# Altium project Module Hub.PrjPcb
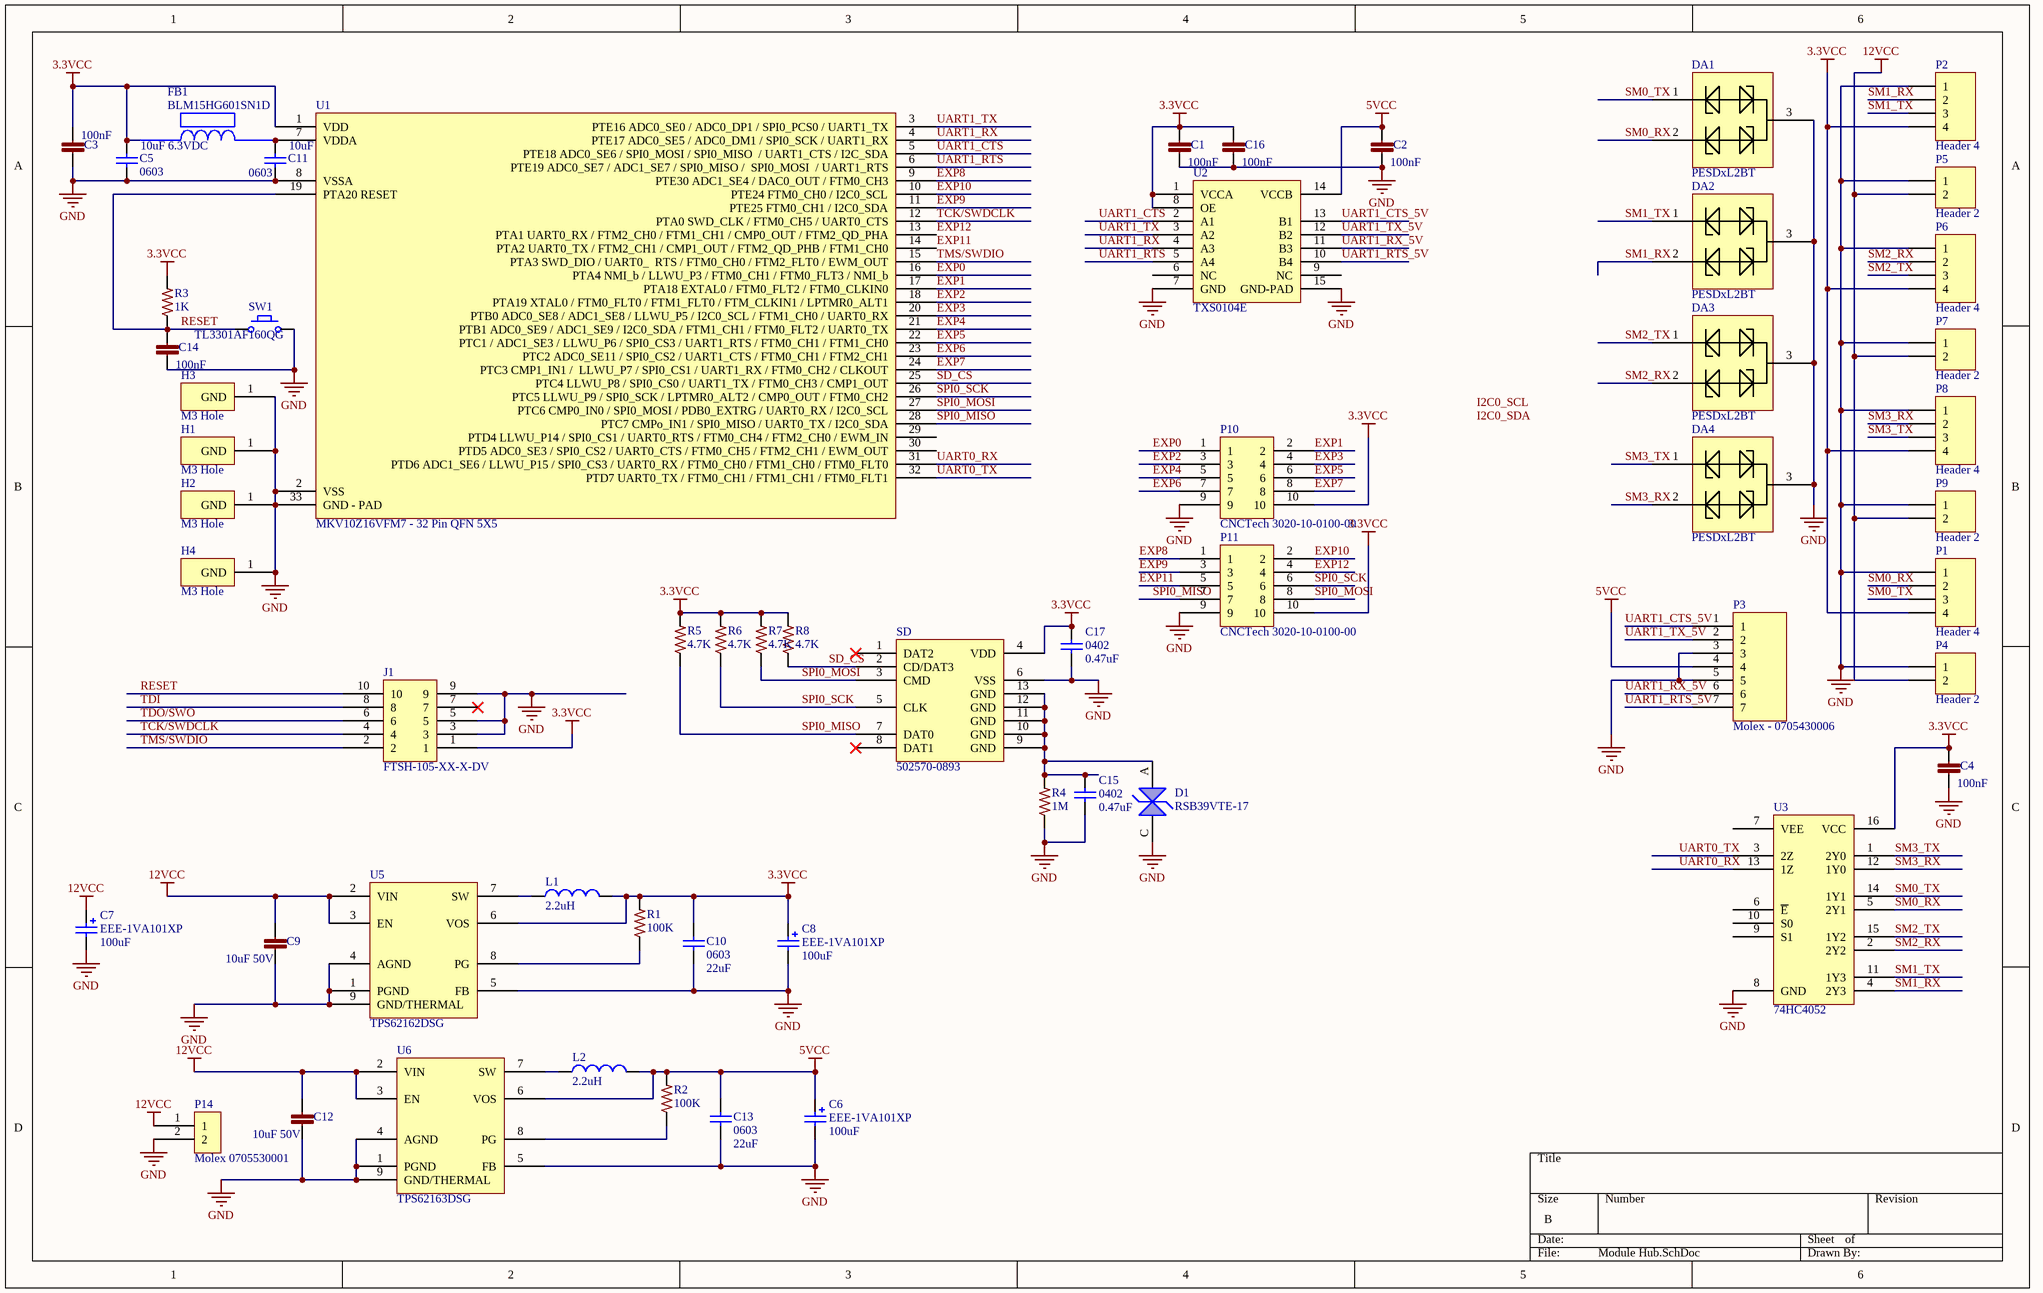
[diagram p0: Module Hub.SchDoc]
1 sheet, 57 parts. Net scope: global (net labels, ports and power ports of the same name join across sheets).
Board file: Module Hub.PcbDoc

## Sheet Module Hub.SchDoc
size B

### Parts
C1  100nF  [C0603]
C2  100nF  [C0603]
C3  100nF  [C0603]
C4  100nF  [C0603]
C5  0603  value 10uF 6.3VDC  [C0603]
C6  EEE-1VA101XP  value 100uF  [EEE-1VA101XP]
C7  EEE-1VA101XP  value 100uF  [EEE-1VA101XP]
C8  EEE-1VA101XP  value 100uF  [EEE-1VA101XP]
C9  10uF 50V  [C1206]
C10  0603  value 22uF  [C0805]
C11  0603  value 10uF  [C0603]
C12  10uF 50V  [C1206]
C13  0603  value 22uF  [C0805]
C14  100nF  [C0402]
C15  value 0.47uF  [C0402]  (hidden comment: 0402)
C16  100nF  [C0603]
C17  value 0.47uF  [C0402]  (hidden comment: 0402)
D1  RSB39VTE-17  [SOD323-R]
DA1  PESDxL2BT  [SOT95P230X110-3N]
DA2  PESDxL2BT  [SOT95P230X110-3N]
DA3  PESDxL2BT  [SOT95P230X110-3N]
DA4  PESDxL2BT  [SOT95P230X110-3N]
FB1  BLM15HG601SN1D  [BLM18PG121SN1D]
H1  M3 Hole  [Hole-3mm]
H2  M3 Hole  [Hole-3mm]
H3  M3 Hole  [Hole-3mm]
H4  M3 Hole  [Hole-3mm]
J1  FTSH-105-XX-X-DV  [FTSH-105-XX-X-DV]
L1  value 2.2uH  [VLS252012T-2R2M1R3]  (hidden comment: VLS252012T-2R2M1R3)
L2  value 2.2uH  [VLS252012T-2R2M1R3]  (hidden comment: VLS252012T-2R2M1R3)
P1  Header 4  [HDR1X4]
P2  Header 4  [HDR1X4]
P3  Molex - 0705430006  [0705530041]
P4  Header 2  [HDR1X2]
P5  Header 2  [HDR1X2]
P6  Header 4  [HDR1X4]
P7  Header 2  [HDR1X2]
P8  Header 4  [HDR1X4]
P9  Header 2  [HDR1X2]
P10  CNCTech 3020-10-0100-00  [3020-10-0100-00]
P11  CNCTech 3020-10-0100-00  [3020-10-0100-00]
P14  Molex 0705530001  [0705530001]
R1  100K  [R0603]
R2  100K  [R0603]
R3  1K  [R0603]
R4  1M  [R0402]
R5  4.7K  [R0603]
R6  4.7K  [R0603]
R7  4.7K  [R0603]
R8  4.7K  [R0603]
SD  502570-0893  [502570-0893 - Molex SD]
SW1  TL3301AF160QG  [TL3301AF160QG]
U1  MKV10Z16VFM7 - 32 Pin QFN 5X5  [MKV10Z16VFM7]
U2  TXS0104E  [RGY  (S-PVQFN-N14)]
U3  74HC4052  [74HC4052]
U5  TPS62162DSG  [DSG8-1600X900TP]
U6  TPS62163DSG  [DSG8-1600X900TP]

### Nets
3.3VCC: C1.1 C3.1 C4.1 C5.2 C8.1 C10.2 C16.1 C17.2 FB1.1 J1.1 L1.2 P1.4 P2.4 P6.4 P8.4 P10.10 P11.10 R1.2 R3.2 R5.2 R6.2 R7.2 R8.2 SD.4(VDD) U1.1(VDD) U2.1(VCCA) U2.8(OE) U3.16(VCC) U5.6(VOS)
5VCC: C2.1 C6.1 C13.2 L2.2 P3.4 R2.2 U2.14(VCCB) U6.6(VOS)
12VCC: C7.1 C9.1 C12.1 P4.2 P5.2 P7.2 P9.2 P14.1 U5.2(VIN) U5.3(EN) U6.2(VIN) U6.3(EN)
GND: C1.2 C2.2 C3.2 C4.2 C5.1 C6.2 C7.2 C8.2 C9.2 C10.1 C11.1 C12.2 C13.1 C14.2 C15.1 C16.2 C17.1 D1.C DA1.3 DA2.3 DA3.3 DA4.3 H1.1(GND) H2.1(GND) H3.1(GND) H4.1(GND) J1.3 J1.5 J1.9 P1.1 P2.1 P3.3 P3.5 P4.1 P5.1 P6.1 P7.1 P8.1 P9.1 P10.9 P11.9 P14.2 R4.1 SD.6(VSS) SW1.2 U1.2(VSS) U1.8(VSSA) U1.33(GND_-_PAD) U2.7(GND) U2.15(GND-PAD) U3.8(GND) U5.1(PGND) U5.4(AGND) U5.5(FB) U5.9(GND/THERMAL) U6.1(PGND) U6.4(AGND) U6.5(FB) U6.9(GND/THERMAL)
EXP0: P10.1 U1.16(PTA4_NMI_b_/_LLWU_P3_/_FTM0_CH1_/_FTM0_FLT3_/_NMI_b)
EXP1: P10.2 U1.17(PTA18_EXTAL0_/_FTM0_FLT2_/_FTM0_CLKIN0)
EXP2: P10.3 U1.18(PTA19_XTAL0_/_FTM0_FLT0_/_FTM1_FLT0_/_FTM_CLKIN1_/_LPTMR0_ALT1)
EXP3: P10.4 U1.20(PTB0_ADC0_SE8_/_ADC1_SE8_/_LLWU_P5_/_I2C0_SCL_/_FTM1_CH0_/_UART0_RX)
EXP4: P10.5 U1.21(PTB1_ADC0_SE9_/_ADC1_SE9_/_I2C0_SDA_/_FTM1_CH1_/_FTM0_FLT2_/_UART0_TX)
EXP5: P10.6 U1.22(PTC1_/_ADC1_SE3_/_LLWU_P6_/_SPI0_CS3_/_UART1_RTS_/_FTM0_CH1_/_FTM1_CH0)
EXP6: P10.7 U1.23(PTC2_ADC0_SE11_/_SPI0_CS2_/_UART1_CTS_/_FTM0_CH1_/_FTM2_CH1)
EXP7: P10.8 U1.24(PTC3_CMP1_IN1_/__LLWU_P7_/_SPI0_CS1_/_UART1_RX_/_FTM0_CH2_/_CLKOUT)
EXP8: P11.1 U1.9(PTE30_ADC1_SE4_/_DAC0_OUT_/_FTM0_CH3)
EXP9: P11.3 U1.11(PTE25_FTM0_CH1_/_I2C0_SDA)
EXP10: P11.2 U1.10(PTE24_FTM0_CH0_/_I2C0_SCL)
EXP11: P11.5 U1.14(PTA2_UART0_TX_/_FTM2_CH1_/_CMP1_OUT_/_FTM2_QD_PHB_/_FTM1_CH0)
EXP12: P11.4 U1.13(PTA1_UART0_RX_/_FTM2_CH0_/_FTM1_CH1_/_CMP0_OUT_/_FTM2_QD_PHA)
RESET: C14.1 J1.10 R3.1 SW1.1 U1.19(PTA20_RESET)
SD_CS: R8.1 SD.2(CD/DAT3) U1.25(PTC4_LLWU_P8_/_SPI0_CS0_/_UART1_TX_/_FTM0_CH3_/_CMP1_OUT)
SM0_RX: DA1.2 P1.2 U3.5(2Y1)
SM0_TX: DA1.1 P1.3 U3.14(1Y1)
SM1_RX: DA2.2 P2.2 U3.4(2Y3)
SM1_TX: DA2.1 P2.3 U3.11(1Y3)
SM2_RX: DA3.2 P6.2 U3.2(2Y2)
SM2_TX: DA3.1 P6.3 U3.15(1Y2)
SM3_RX: DA4.2 P8.2 U3.12(1Y0)
SM3_TX: DA4.1 P8.3 U3.1(2Y0)
SPI0_MISO: P11.7 R5.1 SD.7(DAT0) U1.28(PTC7_CMPo_IN1_/_SPI0_MISO_/_UART0_TX_/_I2C0_SDA)
SPI0_MOSI: P11.8 R7.1 SD.3(CMD) U1.27(PTC6_CMP0_IN0_/_SPI0_MOSI_/_PDB0_EXTRG_/_UART0_RX_/_I2C0_SCL)
SPI0_SCK: P11.6 R6.1 SD.5(CLK) U1.26(PTC5_LLWU_P9_/_SPI0_SCK_/_LPTMR0_ALT2_/_CMP0_OUT_/_FTM0_CH2)
TCK/SWDCLK: J1.4 U1.12(PTA0_SWD_CLK_/_FTM0_CH5_/_UART0_CTS)
TDI: J1.8
TDO/SWO: J1.6
TMS/SWDIO: J1.2 U1.15(PTA3_SWD_DIO_/_UART0___RTS_/_FTM0_CH0_/_FTM2_FLT0_/_EWM_OUT)
UART0_RX: U1.31(PTD6_ADC1_SE6_/_LLWU_P15_/_SPI0_CS3_/_UART0_RX_/_FTM0_CH0_/_FTM1_CH0_/_FTM0_FLT0) U3.13(1Z)
UART0_TX: U1.32(PTD7_UART0_TX_/_FTM0_CH1_/_FTM1_CH1_/_FTM0_FLT1) U3.3(2Z)
UART1_CTS: U1.5(PTE18_ADC0_SE6_/_SPI0_MOSI_/_SPI0_MISO__/_UART1_CTS_/_I2C_SDA) U2.2(A1)
UART1_CTS_5V: P3.1 U2.13(B1)
UART1_RTS: U1.6(PTE19_ADC0_SE7_/_ADC1_SE7_/_SPI0_MISO_/__SPI0_MOSI__/_UART1_RTS) U2.5(A4)
UART1_RTS_5V: P3.7 U2.10(B4)
UART1_RX: U1.4(PTE17_ADC0_SE5_/_ADC0_DM1_/_SPI0_SCK_/_UART1_RX) U2.4(A3)
UART1_RX_5V: P3.6 U2.11(B3)
UART1_TX: U1.3(PTE16_ADC0_SE0_/_ADC0_DP1_/_SPI0_PCS0_/_UART1_TX) U2.3(A2)
UART1_TX_5V: P3.2 U2.12(B2)
NetC11_2: C11.2 FB1.2 U1.7(VDDA)
NetC15_2: C15.2 D1.A R4.2 SD.9(GND) SD.10(GND) SD.11(GND) SD.12(GND) SD.13(GND)
NetL1_1: L1.1 U5.7(SW)
NetL2_1: L2.1 U6.7(SW)
NetR1_1: R1.1 U5.8(PG)
NetR2_1: R2.1 U6.8(PG)

Not connected (* = marked no-connect by the designer): J1 7*; SD 1(DAT2)* 8(DAT1)*; U1 29(PTD4_LLWU_P14_/_SPI0_CS1_/_UART0_RTS_/_FTM0_CH4_/_FTM2_CH0_/_EWM_IN) 30(PTD5_ADC0_SE3_/_SPI0_CS2_/_UART0_CTS_/_FTM0_CH5_/_FTM2_CH1_/_EWM_OUT); U2 6(NC) 9(NC); U3 6(~{E}) 7(VEE) 9(S1) 10(S0)

### Notes on the sheet
- Labels drawn without touching a wire or pin: I2C0_SCL, I2C0_SDA

### Library data of the parts
C1-C4 C16 = C0603C104K5RACTU: CAP CER 0603 100nF 50V 10% X7R; LastRevisionNote: ImportComponents; Published: 23-Apr-2014; Publisher: UltiMachine; LastRevisionDate: 23-Apr-2014; ManufacturerPartNumber: C0603C104K5RACTU; VALUE: 100nF
C5 C11 = C1608JB0J106K080AB: CAP CER 10UF 6.3V 10% JB 0603; MFR: TDK; Voltage: 6.3VDC; Published: 10 - Dec - 2014; LatestRevisionDate: 10 - Dec - 2014; Component Type: Chip Capacitor; MFR Part #: C1608JB0J106K080AB; Part Description: CAP CER 10UF 6.3V 10% JB 0603; Mounting Type: SMT 0603; Datasheet: http://www.tdk.com/pdf/TDKMLCCCapRange.pdf; Height: 0.9mm; Tolerance: 10%; Digikey #: 445-11185-1-ND; PackageReference: 0402
C6-C8 = EEE-1VA101XP: CAP ALUM 100UF 35V 20% SMD; Manufacture: Panasonic; Digikey Part #: PCE3951CT-ND; Price: $0.63; Mount Type: SMT Panasonic VS D Series; Status: Active; Height: 7.70mm; Datasheet: http://industrial.panasonic.com/www-cgi/jvcr13pz.cgi?E+PZ+3+ABA0002+EEE1VA101XP+7+WW; Manufacture Part #: EEE-1VA101XP
C9 C12 = CL31A106KBHNNNE: CAP CER 10UF 50V 10% X5R 1206; Manufacturer: Samsung; LastRevisionNote: ImportComponents; Published: 25-mar-2015; Publisher: UltiMachine; LastRevisionDate: 25-mar-2015; ManufacturerPartNumber: CL31A106KBHNNNE; VALUE: 10uF 50V
C10 C13 = CL21A226KQQNNNE: CAP CER 22UF 6.3V 10% X5R 0805; MFR: Samsung; Voltage: 6.3VDC; Published: April 2015; LatestRevisionDate: April 2015; Component Type: Chip Capacitor; MFR Part #: CL21A226KQQNNNE; Part Description: CAP CER 22UF 6.3V 10% X5R 0805; Mounting Type: SMT 0805; Datasheet: http://www.digikey.com/product-detail/en/CL21A226KQQNNNE/1276-2907-2-ND/3888565; Height: 1mm; Tolerance: 10%; Digikey #: 1276-2907-2-ND; PackageReference: 0805
C14 = GRM155R71C104KA88D: CAP CER 0402 100nF 16V 10% X7R; LastRevisionNote: ImportComponents; Published: 23-Apr-2014; Publisher: UltiMachine; LastRevisionDate: 23-Apr-2014; ManufacturerPartNumber: GRM155R71C104KA88D; VALUE: 100nF
C15 C17 = GRM155R60J474KE19D: 0.47uF 6.3v C0402 - GRM155R60J474KE19D; MFR: Murata; Part Description: CAP CER 0.47UF 6.3V 10% X5R 0402; Tolerance: 10%; Voltage: 6.3VDC; Published: 10 - Dec - 2014; LatestRevisionDate: 10 - Dec - 2014; LatestRevisionNote: Ultimachine Footprint Added; Publisher: Ultimachine; Component Type: Chip Capacitor; MFR Part #: GRM155R60J474KE19D; Mounting Type: SMT 0402; Datasheet: http://search.murata.co.jp/Ceramy/image/img/A01X/G101/ENG/GRM155R60J474KE19-01.pdf; Height: 0.5 ±0.05mm; PackageReference: 0402
D1 = RSB39VTE-17: DIODE TVS
DA1-DA4 = PESDxL2BT: PESDxL2BT TVS Diode Array 2x
H1-H4 = Hole: 3mm Hole
J1 = ARM Cortex JTAG-DEBUG Header
L1 L2 = VLS252012T-2R2M1R3: MFR: TDK Corporation; Published: April 2015; LatestRevisionDate: April 2015; LatestRevisionNote: IPC-7351 Footprint Added.; PackageReference: Custom Wound INductor; Publisher: Adam Vadala-Roth; PackageDescription: Wire Wound Inductor Package; MFR#: VLS252012T-2R2M1R3
P1 P2 P6 P8 = Header 4: Header, 4-Pin; LatestRevisionDate: 17-Jul-2002; LatestRevisionNote: Re-released for DXP Platform.; Publisher: Altium Limited
P3 = 0705530041: MFR: Molex; MFR#: 0705530041
P4 P5 P7 P9 = Header 2: Header, 2-Pin; LatestRevisionDate: 17-Jul-2002; LatestRevisionNote: Re-released for DXP Platform.; Publisher: Altium Limited
P10 P11 = 3020-10-0100-00: Manufacture Part #: 3020-10-0100-00; Manufacturer: CNCTech; Type: SMD Shrouded Pin Header; Pin Count: 10; Price: $0.48; Digikey Part #: 1175-1609-ND
P14 = 0705530001: Molex 0705530002 Right Angle 2.54mm Shrouded Header; MFR: Molex; MFR#: 0705530001; Type: 2.54mm shrouded 2 pin right angle throughhole connector; Digikey #: WM4900-ND
R1 R2 = RC0603FR-07100KL: RES 100K OHM 1/10W 1% 0603 SMD; LastRevisionNote: ImportComponents; Published: 23-Apr-2014; Publisher: UltiMachine; LastRevisionDate: 23-Apr-2014; ManufacturerPartNumber: RC0603FR-07100KL; VALUE: 100K
R3 = ERJ-3EKF1001V: RES 0603 1K 100mW 1%; LastRevisionNote: ImportComponents; Published: 23-Apr-2014; Publisher: UltiMachine; LastRevisionDate: 23-Apr-2014; ManufacturerPartNumber: ERJ-3EKF1001V; VALUE: 1K
R4 = ERJ2GEJ105X: RES 0402 1M 100mW 5%; LastRevisionNote: ImportComponents; Published: 23-Apr-2014; Publisher: UltiMachine; LastRevisionDate: 23-Apr-2014; ManufacturerPartNumber: ERJ2GEJ105X; VALUE: 1M
R5-R8 = ERJ3EKF4701V: RES 0603 4.7K 100mW 1%; LastRevisionNote: ImportComponents; Published: 23-Apr-2014; Publisher: UltiMachine; LastRevisionDate: 23-Apr-2014; ManufacturerPartNumber: ERJ3EKF4701V; VALUE: 4.7K
SD = 502570-0893: microSD 502570-0893 Molex Part
U1 = MKV10Z16VFM7: IC MCU ARM Cortex M0+ 16KB 32QFN 75MHZ; MFR: FreeScale; MFR#: MKV10Z16VFM7; height: 1mm; Price: $2.50
U2 = TXS0104E: TXS0104E - Bidriectional Opendrain/pushpull level shift; MFR: Texas Instruments; MFR Part #: TXS0104ERGYR; Active: Yes; Digikey Part #: 296-20698-2-ND; Height: 1mm; mounting Type: SMD; Datasheet: http://www.ti.com/lit/ds/symlink/txs0104e.pdf; Lead Free ?: RhoS
U3 = 74HC4052: Dual 4-channel analog multiplexer/demultiplexer; MFR: NXP; Mouting Type: SMT; MFR#: 74HC4052; Type: 74 logic, analog mulitplexer/demultiplexer; Datasheet: http://www.nxp.com/documents/data_sheet/74HC_HCT4052.pdf
U5 U6 = TPS62162SOP
SW1 = TL3301AF160QG: MFR: *; MFR#: TL3301AF160QG; Type: SMD Momentary Tactile Switch; Height: *